# Altium schematic sheet Schematic_plan.SchDoc
size A4; SheetNumber: 1; SheetTotal: 6
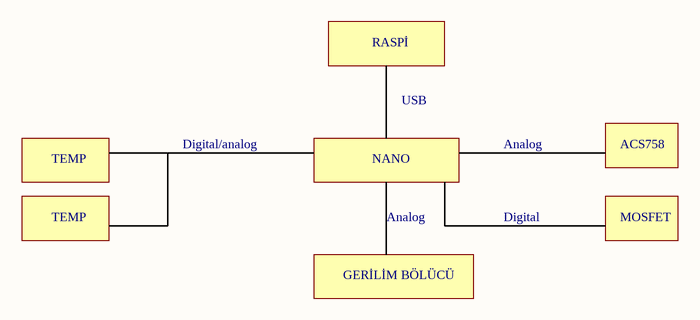
[diagram p0: Schematic_plan.SchDoc]

## Notes on the sheet
- RASPİ
- USB
- TEMP
- Digital/analog
- NANO
- Analog
- ACS758
- GERİLİM BÖLÜCÜ
- Digital
- MOSFET